# EAGLE design shiva (EAGLE 7.3.0)
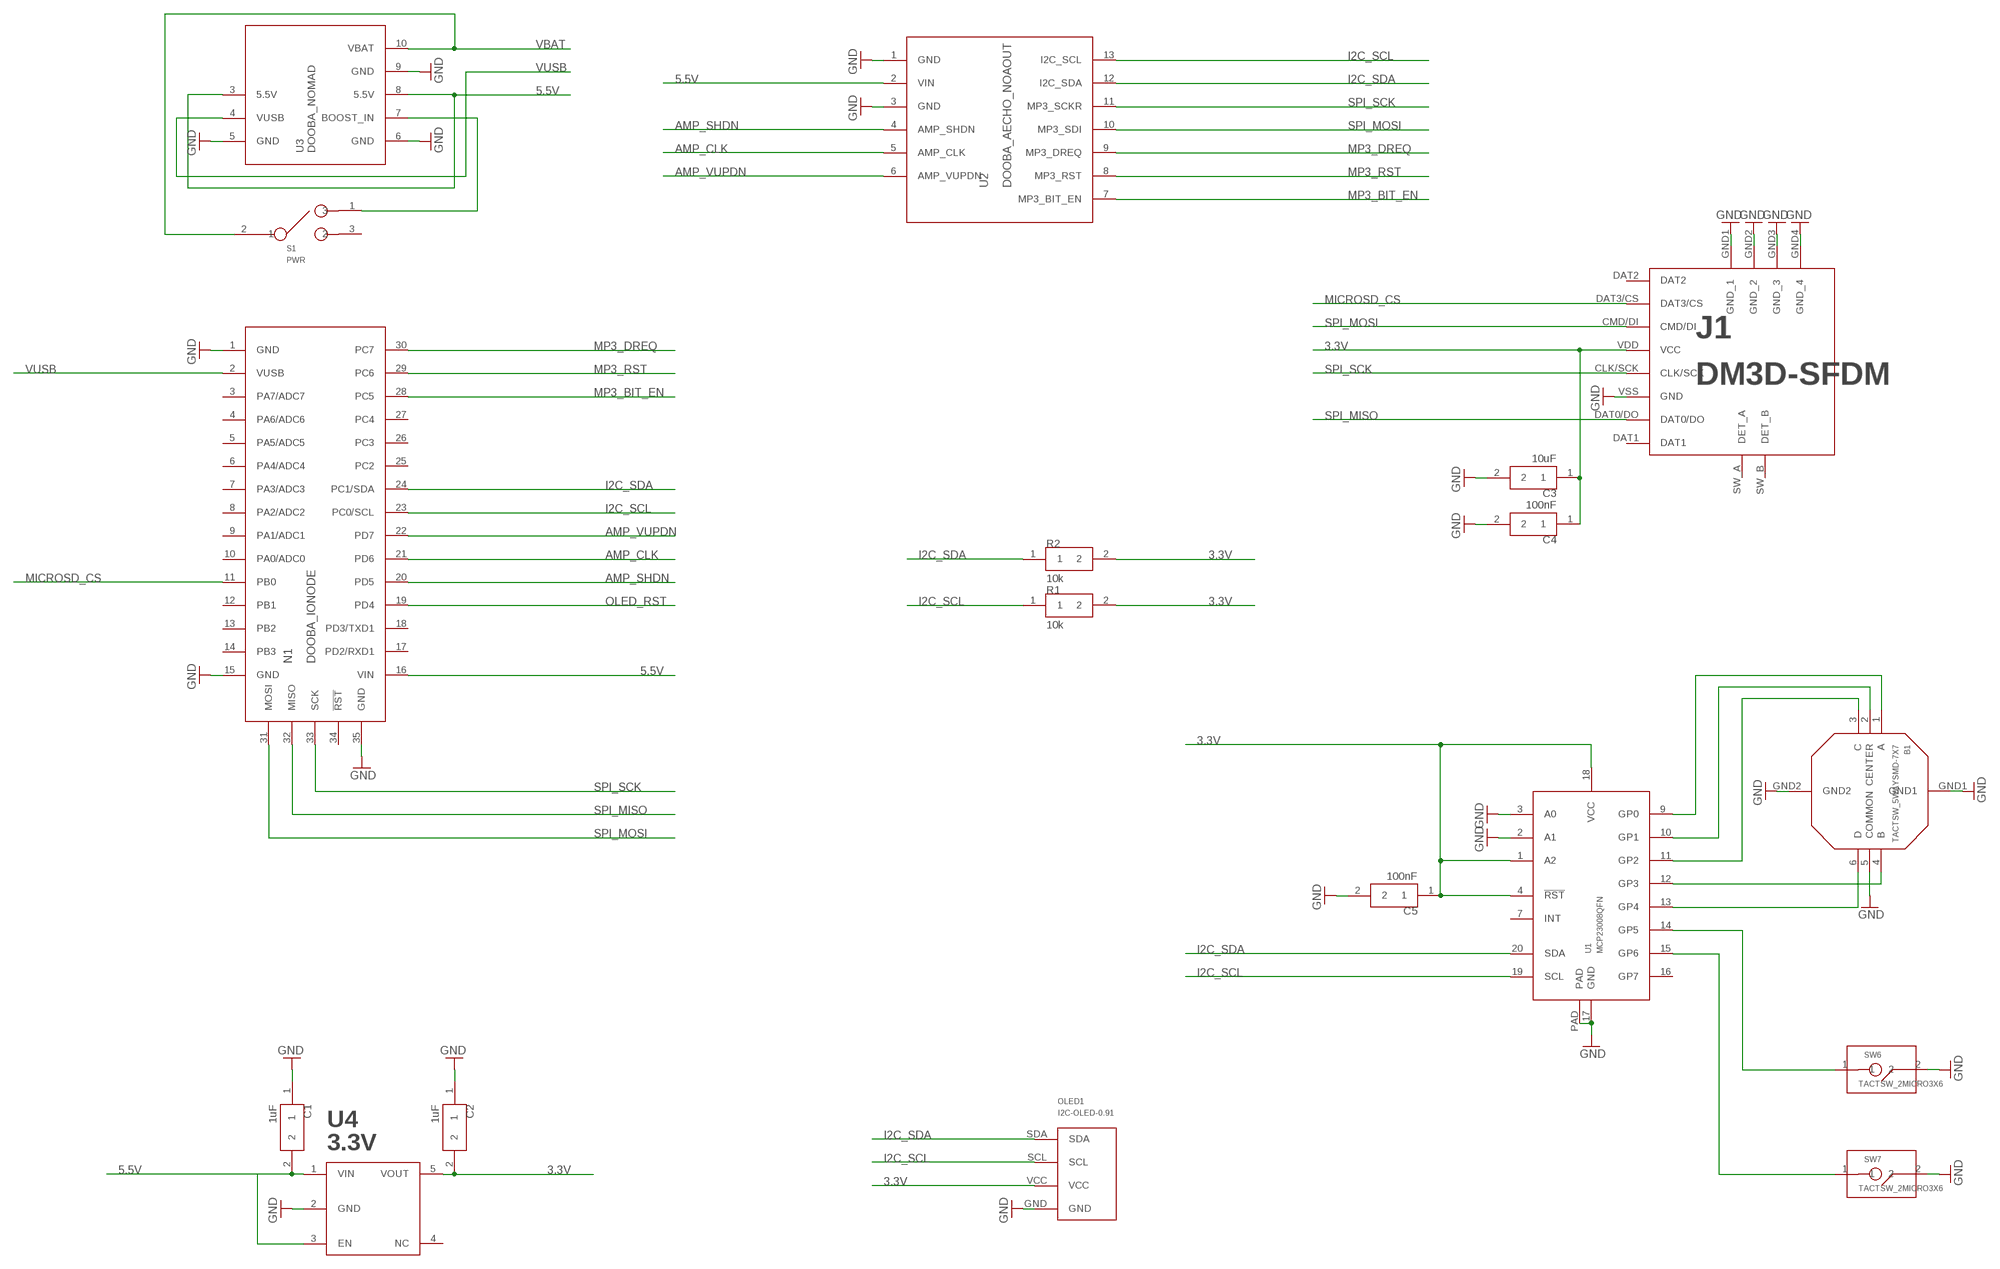
[diagram p0: schematic, sheet 1]

## Parts
B1  TACTSW_5WAYSMD-7X7  [TACTSW-5WAY-7X7]
C1  1uF  CAP0805  [0805]
C2  1uF  CAP0805  [0805]
C3  10uF  CAP0805  [0805]
C4  100nF  CAP0805  [0805]
C5  100nF  CAP0805  [0805]
J1  DM3D-SFDM  [DM3D-SF]
N1  DOOBA_IONODE  [DOOBA_IONODE]
OLED1  I2C-OLED-0.91  [I2C-OLED-0.91]
R1  10k  RES0805  [0805]
R2  10k  RES0805  [0805]
S1  PWR  SWITCH_SPDT  [JS102011]
SW6  TACTSW_2MICRO3X6  [TACTSW_MICRO3X6]
SW7  TACTSW_2MICRO3X6  [TACTSW_MICRO3X6]
U1  MCP23008QFN  [20-VQFN]
U2  DOOBA_AECHO_NOAOUT  [DOOBA_AECHO_NOAOUT]
U3  DOOBA_NOMAD  [DOOBA_NOMAD]
U4  3.3V  LP3985SOT23-5  [SOT23-5]

## Nets
3.3V: C2.2 C3.1 C4.1 C5.1 J1.VDD(VCC) OLED1.VCC R1.2 R2.2 U1.1(A2) U1.4(!RST) U1.18(VCC) U4.5(VOUT)
5.5V: C1.2 N1.16(VIN) U2.2(VIN) U3.3(5.5V) U3.8(5.5V) U4.1(VIN) U4.3(EN)
AMP_CLK: N1.21(PD6) U2.5(AMP_CLK)
AMP_SHDN: N1.20(PD5) U2.4(AMP_SHDN)
AMP_VUPDN: N1.22(PD7) U2.6(AMP_VUPDN)
GND: B1.5(COMMON) B1.GND1 B1.GND2 C1.1 C2.1 C3.2 C4.2 C5.2 J1.GND1(GND_1) J1.GND2(GND_2) J1.GND3(GND_3) J1.GND4(GND_4) J1.VSS(GND) N1.1(GND) N1.15(GND) N1.35(GND) OLED1.GND SW6.2 SW7.2 U1.2(A1) U1.3(A0) U1.17(GND) U1.PAD U2.1(GND) U2.3(GND) U3.5(GND) U3.6(GND) U3.9(GND) U4.2(GND)
I2C_SCL: N1.23(PC0/SCL) OLED1.SCL R1.1 U1.19(SCL) U2.13(I2C_SCL)
I2C_SDA: N1.24(PC1/SDA) OLED1.SDA R2.1 U1.20(SDA) U2.12(I2C_SDA)
MICROSD_CS: J1.DAT3/CS N1.11(PB0)
MP3_BIT_EN: N1.28(PC5) U2.7(MP3_BIT_EN)
MP3_DREQ: N1.30(PC7) U2.9(MP3_DREQ)
MP3_RST: N1.29(PC6) U2.8(MP3_RST)
N$1: B1.1(A) U1.9(GP0)
N$2: B1.2(CENTER) U1.10(GP1)
N$3: B1.3(C) U1.11(GP2)
N$4: B1.6(D) U1.13(GP4)
N$5: B1.4(B) U1.12(GP3)
N$6: SW6.1 U1.14(GP5)
N$7: SW7.1 U1.15(GP6)
N$11: S1.1 U3.7(BOOST_IN)
OLED_RST: N1.19(PD4)
SPI_MISO: J1.DAT0/DO N1.32(MISO)
SPI_MOSI: J1.CMD/DI N1.31(MOSI) U2.10(MP3_SDI)
SPI_SCK: J1.CLK/SCK N1.33(SCK) U2.11(MP3_SCKR)
VBAT: S1.2 U3.10(VBAT)
VUSB: N1.2(VUSB) U3.4(VUSB)
Unconnected: J1.DAT1 J1.DAT2 J1.SW_A(DET_A) J1.SW_B(DET_B) N1.3(PA7/ADC7) N1.4(PA6/ADC6) N1.5(PA5/ADC5) N1.6(PA4/ADC4) N1.7(PA3/ADC3) N1.8(PA2/ADC2) N1.9(PA1/ADC1) N1.10(PA0/ADC0) N1.12(PB1) N1.13(PB2) N1.14(PB3) N1.17(PD2/RXD1) N1.18(PD3/TXD1) N1.25(PC2) N1.26(PC3) N1.27(PC4) N1.34(!RST) S1.3 U1.7(INT) U1.16(GP7) U4.4(NC)

## Library data of the parts
B1 = dooba:TACTSW_5WAY
C1-C5 = dooba:CAP
J1 = dooba:DM3D-SF
N1 = dooba:DOOBA_IONODE
OLED1 = dooba:I2C-OLED-0.91
R1 R2 = dooba:RES
S1 = dooba:SWITCH_SPDT
SW6 SW7 = dooba:TACTSW_2
U1 = dooba:MCP23008
U2 = dooba:DOOBA_AECHO_NOAOUT
U3 = dooba:DOOBA_NOMAD
U4 = dooba:LP3985

## Board
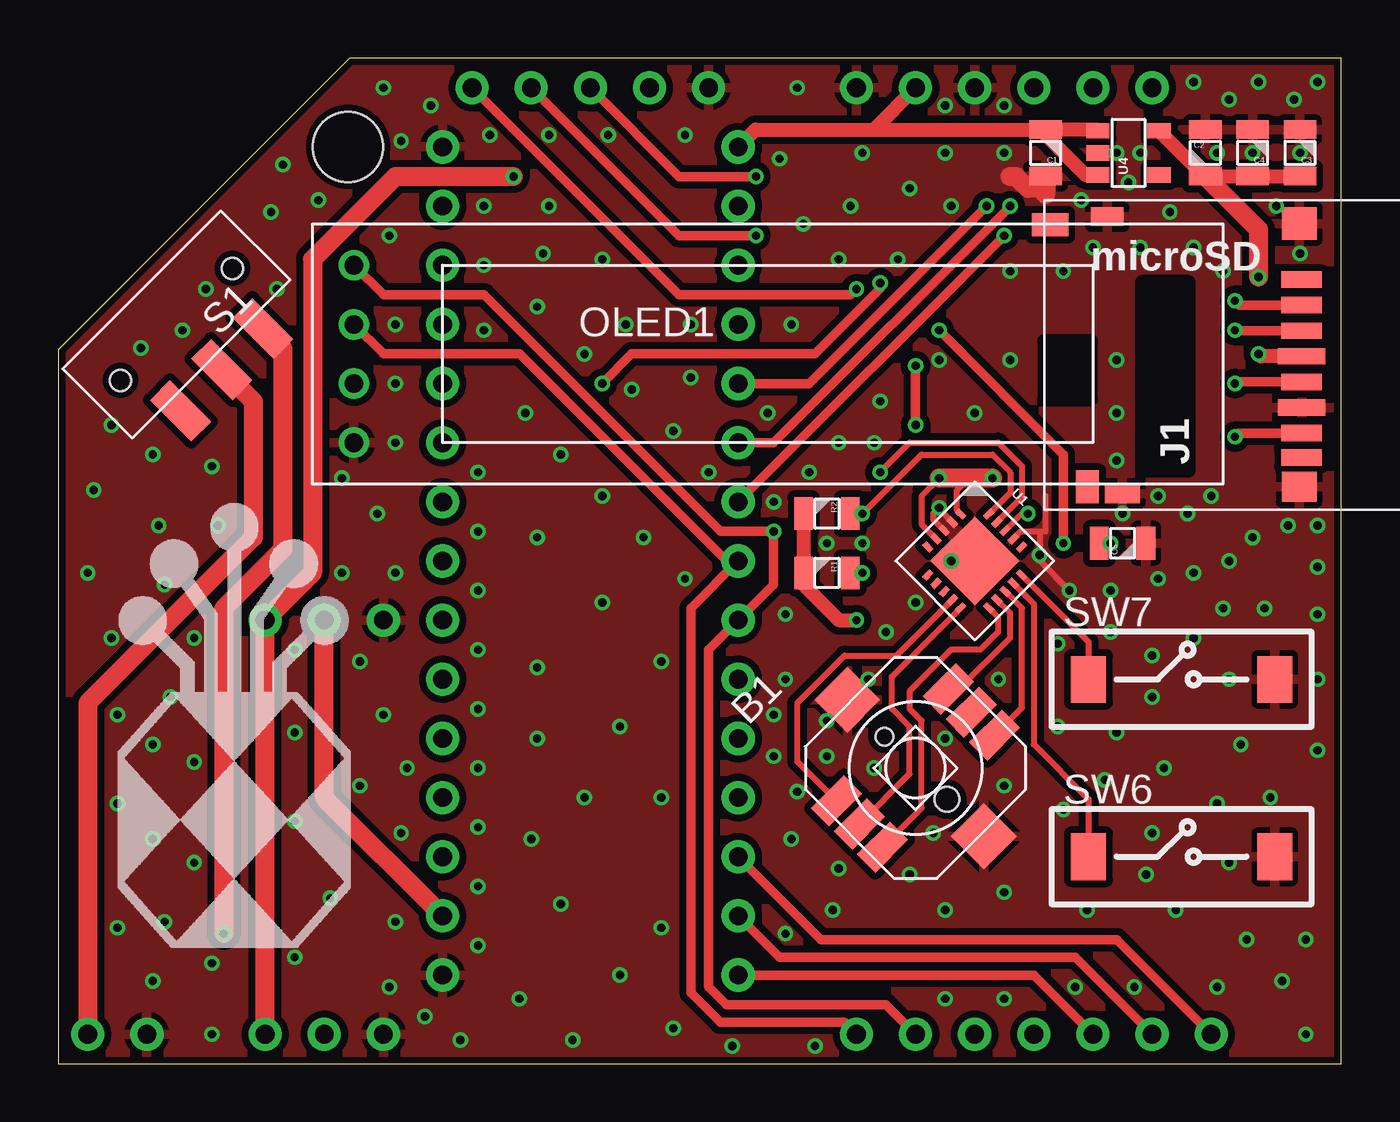
[diagram p1: board, top side]
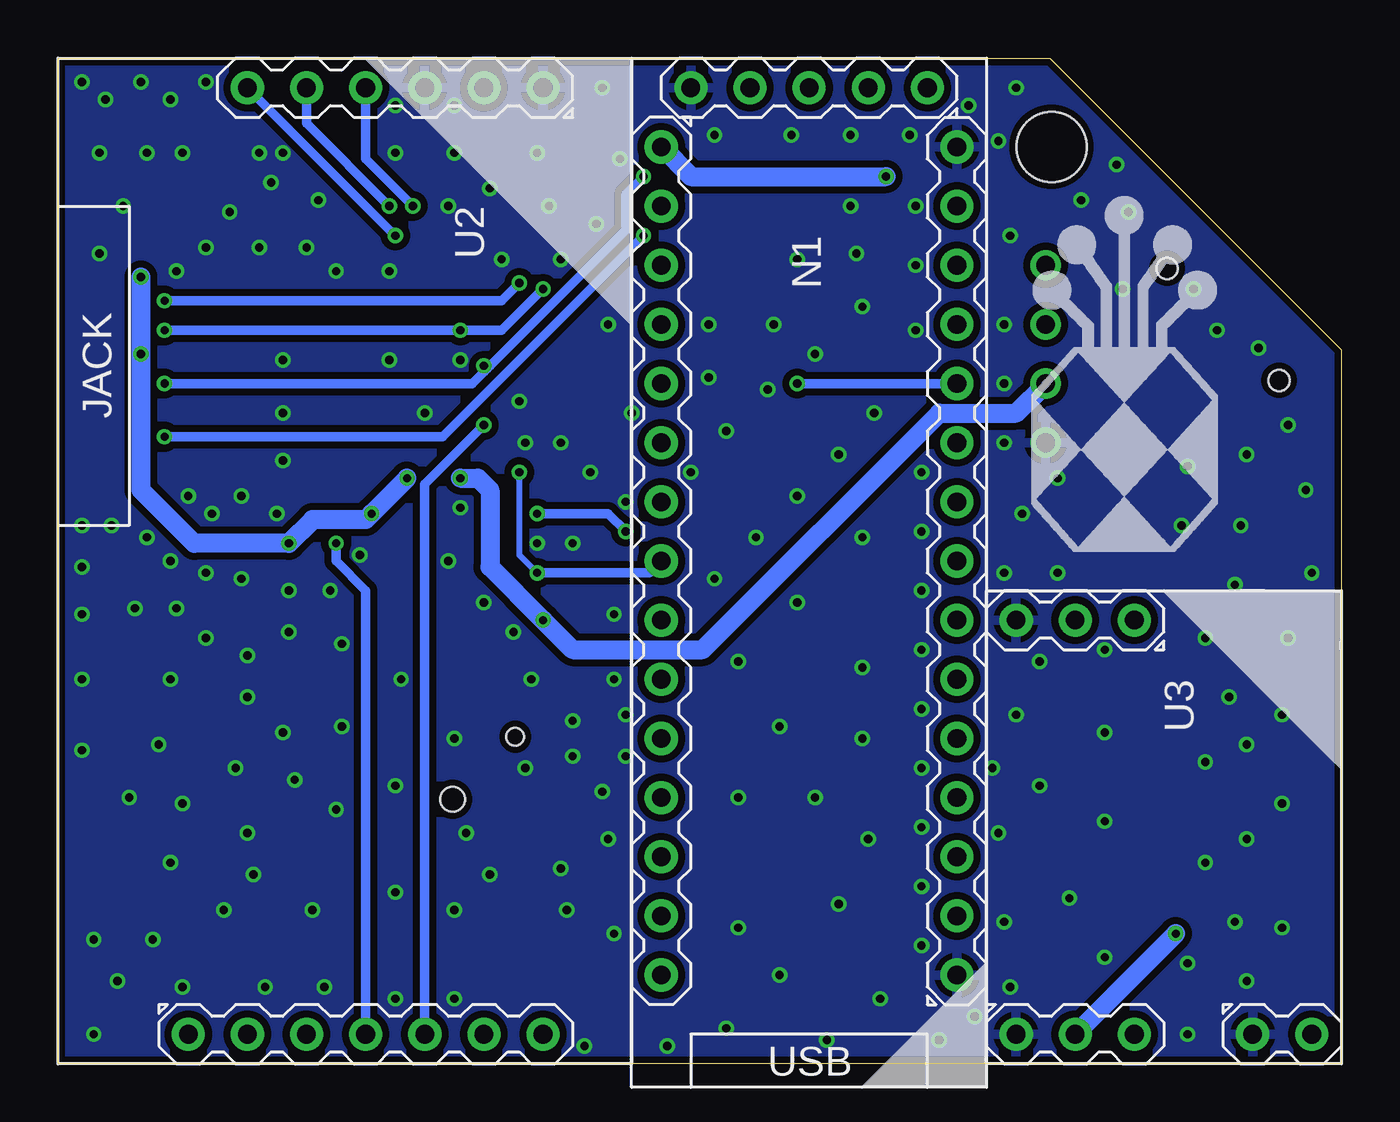
[diagram p2: board, bottom side, seen from below]

Size 55.12 x 43.18 mm. Coordinates in mm from the lower left corner, seen from the top.
Outline: 0,0 55.12,0 55.12,43.18 12.51,43.18 0,30.67 0,0
Copper layers (1*16): Top 0.035mm / dielectric 1.5mm / Bottom 0.035mm
Design rules "dooba": minimum track width 6mil, minimum drill 12mil, track to track 6mil, track to pad 6mil, pad to pad 6mil, via to via 6mil, smd to smd 0mil, copper to edge 10mil, drill to drill 10mil, minimum pad ring 10mil, minimum via ring 6mil, stop-mask expansion 2mil, vias tented up to drill 25mil, thermal gap 10mil
Holes 3 mm at 12.45,39.37

### Footprints (pad centres in the part's own frame; a part is rotated, then mirrored left to right if it is on the bottom)
TACTSW-5WAY-7X7 = smd 2 x 1.1: 1 -3.4,1.4; 2 -3.4,0; 3 -3.4,-1.4; 4 3.4,1.4; 5 3.4,0; 6 3.4,-1.4 | smd 2 x 2: GND1 0,4.15; GND2 0,-4.15 | hole 0.75: 0,1.9 | hole 1.05: 0,-1.9
0805 = smd 0.8 x 1.4: 1 -1,0; 2 1,0
DM3D-SF = smd 0.7 x 1.75: CLK/SCK -1.2,-1.34; CMD/DI 1,-1.34; DAT0/DO -3.4,-1.34; DAT1 -4.45,-1.34; DAT2 3.2,-1.34; DAT3/CS 2.1,-1.34 | smd 0.8 x 1.5: GND1 -6,6.36 | smd 0.8 x 1.4: GND2 5.9,7.01 | smd 1.4 x 1.5: GND3 5.6,-1.24 | smd 1.3 x 1.5: GND4 -5.7,-1.24 | smd 1 x 1.55: SW_A 5.55,9.46 | smd 1.4 x 1: SW_B -5.7,7.86 | smd 0.7 x 2.032: VDD -0.1,-1.34; VSS -2.3,-1.34
DOOBA_IONODE = drill 0.8 pad 1.422: 1 16.51,6.35; 2 13.97,6.35; 3 11.43,6.35; 4 8.89,6.35; 5 6.35,6.35; 6 3.81,6.35; 7 1.27,6.35; 8 -1.27,6.35; 9 -3.81,6.35; 10 -6.35,6.35; 11 -8.89,6.35; 12 -11.43,6.35; 13 -13.97,6.35; 14 -16.51,6.35; 15 -19.05,6.35; 16 -19.05,-6.35; 17 -16.51,-6.35; 18 -13.97,-6.35; 19 -11.43,-6.35; 20 -8.89,-6.35; 21 -6.35,-6.35; 22 -3.81,-6.35; 23 -1.27,-6.35; 24 1.27,-6.35; 25 3.81,-6.35; 26 6.35,-6.35; 27 8.89,-6.35; 28 11.43,-6.35; 29 13.97,-6.35; 30 16.51,-6.35; 31 -21.59,5.08; 32 -21.59,2.54; 33 -21.59,0; 34 -21.59,-2.54; 35 -21.59,-5.08
I2C-OLED-0.91 = drill 0.8: GND -17.78,-3.81; SCL -17.78,1.27; SDA -17.78,3.81; VCC -17.78,-1.27
JS102011 = smd 1.2 x 2.5: 1 -2.5,2.75; 2 0,2.75; 3 2.5,2.75 | hole 0.9: -3.4,0; 3.4,0
TACTSW_MICRO3X6 = smd 1.5 x 2: 1 -4,0; 2 4,0
20-VQFN = smd 0.45 x 0.26: 1 -1.85,1; 2 -1.85,0.5; 3 -1.85,0; 4 -1.85,-0.5; 5 -1.85,-1; 11 1.85,-1; 12 1.85,-0.5; 13 1.85,0; 14 1.85,0.5; 15 1.85,1 | smd 0.26 x 0.45: 6 -1,-1.85; 7 -0.5,-1.85; 8 0,-1.85; 9 0.5,-1.85; 10 1,-1.85; 16 1,1.85; 17 0.5,1.85; 18 0,1.85; 19 -0.5,1.85; 20 -1,1.85 | smd 2.7 x 2.7: PAD 0,0
DOOBA_AECHO_NOAOUT = drill 0.8 pad 1.422: 1 -20.32,6.35; 2 -20.32,3.81; 3 -20.32,1.27; 4 -20.32,-1.27; 5 -20.32,-3.81; 6 -20.32,-6.35; 7 20.32,-8.89; 8 20.32,-6.35; 9 20.32,-3.81; 10 20.32,-1.27; 11 20.32,1.27; 12 20.32,3.81; 13 20.32,6.35
DOOBA_NOMAD = drill 0.8 pad 1.422: 3 -8.89,-1.27; 4 -8.89,-3.81; 5 -8.89,-6.35; 6 8.89,-6.35; 7 8.89,-3.81; 8 8.89,-1.27; 9 8.89,3.81; 10 8.89,6.35
SOT23-5 = smd 0.66 x 1: 1 0.95,1.315; 2 0,1.315; 3 -0.95,1.315; 4 -0.95,-1.315; 5 0.95,-1.315

### Placement (x,y rotation side)
B1  36.83,12.7 45 top
C1  42.42,39.12 90 top
C2  49.28,39.12 270 top
C3  53.34,39.12 90 top
C4  51.31,39.12 90 top
C5  45.72,22.35 0 top
J1  52.07,30.48 90 top
N1  22.86,20.32 270 bottom
OLED1  30.48,30.48 0 top
R1  33.02,21.08 180 top
R2  33.02,23.62 180 top
S1  5.08,31.75 225 top
SW6  48.26,8.89 0 top
SW7  48.26,16.51 0 top
U1  39.37,21.59 315 top
U2  40.64,21.59 270 bottom
U3  7.62,10.16 270 bottom
U4  45.97,39.12 90 top

### Tracks (layer width: path | path; a pad name or v marks a point on that pad's centre or on a via)
3.3V  (via drill 0.36)
  Top 0.254: U1.18 41.4,23.62 v41.66,23.62 | v37.85,25.15 37.08,24.38 37.08,23.17 U1.4 | U1.1 38.61,23.77 38.61,24.64 39.12,25.15
  Top 0.61: U4.5 49.24,38.12 C2.2 C4.1 C3.1 | R2.2 R1.2 32,21.07 32,20.57 33.53,19.05 v34.29,19.05 | J1.VDD 51.66,30.38 v51.56,30.48 | C5.1 v45.21,22.35
  Top 0.813: v40.13,25.15 39.12,25.15 v37.85,25.15 | C2.2 51.56,35.83 v51.56,33.78
  Bottom 0.813: v40.13,25.15 v41.66,23.62 41.91,23.37 44.2,23.37 v45.21,22.35 49.28,22.35 51.56,24.64 v51.56,30.48 v51.56,33.78 | v37.85,25.15 37.08,25.15 36.58,24.64 36.58,21.34 v34.29,19.05 33.02,17.78 27.43,17.78 17.27,27.94 13.97,27.94 OLED1.VCC
5.5V  (via drill 0.36)
  Top 0.61: U4.1 44.61,40.12 C1.2 | C1.2 42.42,39.88 44.13,38.17 U4.3 | N1.16 29.96,40.12 35.04,40.12 | 35.04,40.12 C1.2 | U2.2 35.04,40.12
  Top 0.813: v19.56,38.1 14.48,38.1 10.92,34.54 10.92,21.08 U3.3 U3.8
  Bottom 0.813: N1.16 27.94,38.1 v19.56,38.1
AMP_CLK  (via drill 0.36)
  Top 0.406: N1.21 30.73,26.67 v40.89,36.83
  Bottom 0.406: v40.89,36.83 44.45,40.39 U2.5
AMP_SHDN  (via drill 0.36)
  Top 0.406: N1.20 32.26,29.21 v39.88,36.83
  Bottom 0.406: v39.88,36.83 41.91,38.86 U2.4
AMP_VUPDN  (via drill 0.36)
  Top 0.406: N1.22 v40.64,35.56
  Bottom 0.406: v40.64,35.56 U2.6
GND  (via drill 0.36)
  Top 0.254: U1.17 41.35,22.86 42.16,22.86 | 42.16,22.86 42.16,21.59 v43.43,20.32 | U1.3 37.59,23.37 37.59,23.62 v37.85,23.88 37.85,23.82 U1.2 | U1.PAD v38.35,21.59 | 42.16,22.86 42.42,22.86 42.42,24.38
  Top 0.813: C1.1 42.42,37.34 42.16,37.59 41.66,37.59 41.15,38.1 40.89,38.1
  other vias: 38.1,41.15 40.64,41.15 40.64,39.12 38.1,39.12 36.07,34.54 38.35,36.83 33.53,34.54 32,36.07 30.99,38.86 34.54,39.12 36.58,37.59 34.04,36.83 26.92,39.88 31.75,41.91 23.62,39.88 21.08,39.88 18.54,39.88 13.97,41.91 9.65,38.61 11.18,37.08 9.14,36.58 14.22,35.56 14.48,31.75 14.48,29.21 14.48,26.67 18.29,31.5 22.61,30.48 27.18,31.75 24.38,31.75 21.08,36.83 18.29,36.83 18.29,34.29 20.57,32.51 23.37,34.54 20.83,34.8 31.5,31.75 30.48,27.94 24.64,28.96 27.18,29.46 27.94,25.4 26.42,27.18 35.31,28.45 35.05,26.67 30.73,24.13 32.26,25.4 33.53,26.67 33.02,22.35 31.24,19.3 36.83,19.81 35.56,18.54 31.24,16.51 26.92,20.83 25.15,22.61 23.37,24.38 21.59,26.16 20.07,27.94 14.48,21.08 12.19,21.08 12.19,25.15 13.72,23.62 18.03,25.4 25.91,17.27 23.37,19.81 20.57,22.61 42.93,18.03 45.21,18.54 47.24,20.83 45.21,20.32 47.24,24.38 49.53,24.38 48.51,23.62 48.77,21.08 50.29,21.59 51.31,22.61 34.54,22.35 34.8,16.51 33.02,14.73 40.39,16.51 38.1,13.97 30.73,14.99 30.73,13.21 31.75,11.68 37.59,9.91 40.64,11.94 40.64,7.37 38.1,6.6 33.27,6.6 31.5,9.65 36.58,8.13 33.53,8.38 35.05,12.7 33.02,13.21 43.18,10.92 42.93,14.48 44.96,12.19 52.83,23.11 54.1,23.11 54.1,21.34 54.1,19.3 54.1,16.51 54.1,13.46 51.82,19.56 48.77,18.29 46.99,15.75 50.8,13.72 47.5,12.7 52.07,11.43 46.99,9.91 50.29,8.64 49.78,11.18 50.29,16.51 39.37,27.94 45.47,27.94 45.47,25.91 45.72,23.62 45.47,30.23 40.89,30.23 37.85,30.23 40.89,34.04 44.45,35.05 43.18,34.04 46.48,35.05 50.04,34.04 48.77,35.05 47.75,36.58 43.94,37.08 52.32,36.83 53.34,34.8 53.34,39.12 51.31,39.12 49.78,39.12 54.1,42.16 48.77,42.16 51.56,42.16 50.29,41.4 53.09,41.4 46.48,39.12 45.47,39.12 45.97,37.85 40.64,2.79 44.2,6.6 48.01,6.6 49.78,3.3 53.59,1.27 53.59,5.33 51.05,5.33 52.58,3.56 46.99,17.53 50.04,19.56 45.47,14.22 46.74,8.13 16,41.15 14.73,39.62 9.4,33.27 6.35,33.27 3.56,30.73 5.33,31.5 2.29,27.43 4.06,26.16 6.6,25.65 6.86,23.11 4.57,20.57 2.29,18.29 1.27,21.08 4.32,23.11 1.52,24.64 5.84,18.29 2.54,14.99 5.84,12.95 4.83,15.75 2.54,11.18 5.84,8.64 2.54,5.84 6.6,4.32 6.6,1.27 4.06,3.56 4.06,13.72 4.06,9.65 4.57,6.1 10.16,17.78 10.16,14.22 10.16,10.41 14.48,6.1 10.16,4.57 14.22,3.3 11.68,7.11 14.73,9.91 12.95,11.94 12.95,17.27 13.97,14.99 14.99,12.7 15.75,2.03 17.27,1.02 22.1,1.02 32.51,0.76 28.96,0.76 26.42,1.52 19.81,2.79 24.13,3.81 25.91,5.84 25.91,11.43 24.13,14.48 18.03,20.32 18.03,17.78 18.03,15.24 18.03,12.7 18.03,10.16 18.03,7.62 18.03,5.08 18.03,22.86 21.59,6.86 22.61,11.43 20.57,17.02 20.32,9.65 20.57,13.97 31.24,5.59 38.1,2.79 43.69,3.3 46.23,3.3 42.16,21.84
  pour Top (isolate 0.305): 12.45,43.18 55.88,43.18 55.88,0 0,0 0,30.73
  pour Bottom (isolate 0.305): 12.45,43.18 55.88,43.18 55.88,0 0,0 0,30.73
I2C_SCL  (via drill 0.36)
  Top 0.254: v35.31,25.4 36.58,26.67 40.39,26.67 41.4,25.65 41.4,24.33 U1.19
  Top 0.406: OLED1.SCL 13.97,30.48 19.81,30.48 28.7,21.59 N1.23 27.18,19.56 27.18,3.05 28.45,1.78 33.78,1.78 U2.13 | v34.54,21.08 R1.1
  Bottom 0.254: v34.54,21.08 35.31,21.84 v35.31,25.4
  Bottom 0.406: N1.23 29.72,21.08 v34.54,21.08
I2C_SDA  (via drill 0.36)
  Top 0.254: v34.54,23.62 37.08,26.16 40.13,26.16 40.89,25.4 40.89,24.53 U1.20
  Top 0.406: OLED1.SDA 13.97,33.02 18.29,33.02 28.45,22.86 v30.73,22.86 30.73,20.57 N1.24 27.94,17.78 27.94,3.3 28.7,2.54 35.56,2.54 U2.12 | v34.54,23.62 R2.1
  Bottom 0.406: v30.73,22.86 31.5,23.62 v34.54,23.62
MICROSD_CS  (via drill 0.36)
  Top 0.406: v23.37,29.21 24.64,30.48 32.51,30.48 35.31,33.27 v35.31,33.53 | v50.55,32.77 50.73,32.58 J1.DAT3/CS
  Bottom 0.406: N1.11 v23.37,29.21 | v35.31,33.53 36.07,32.77 v50.55,32.77
MP3_BIT_EN
  Top 0.406: N1.28 32.77,5.33 45.47,5.33 U2.7
MP3_DREQ
  Top 0.406: U2.9 41.91,3.81 N1.30
MP3_RST
  Top 0.406: U2.8 43.69,4.57 30.99,4.57 N1.29
N$1
  Top 0.254: B1.1 31.75,12.97 31.75,15.49 33.78,17.53 36.01,17.53 U1.9
N$2
  Top 0.254: B1.2 36.58,12.45 36.58,14.48 35.81,15.24 35.81,16.62 U1.10
N$3
  Top 0.254: B1.3 37.08,10.97 37.08,14.73 36.58,15.24 36.58,16 38.35,17.78 39.62,17.78 40.39,18.54 40.39,19.16 U1.11
N$4
  Top 0.254: B1.6 41.4,15.29 41.4,19.56 U1.13
N$5
  Top 0.254: B1.4 38.7,16.09 40.89,18.29 40.89,19.36 U1.12
N$6
  Top 0.254: U1.14 41.91,19.76 41.91,13.72 44.26,11.37 SW6.1
N$7
  Top 0.254: U1.15 44.26,18.11 SW7.1
N$11  (via drill 0.36)
  Top 0.813: S1.1 9.65,30.71 9.65,22.1 7.11,19.56 v7.11,5.59
  Bottom 0.813: v7.11,5.59 U3.7
SPI_MISO  (via drill 0.36)
  Top 0.406: N1.32 26.67,35.56 v29.97,35.56 | v50.55,26.92 50.7,27.08 J1.DAT0/DO
  Bottom 0.406: v29.97,35.56 38.61,26.92 v50.55,26.92
SPI_MOSI  (via drill 0.36)
  Top 0.406: N1.31 26.67,33.02 34.04,33.02 v34.29,33.27 | v50.55,31.5 50.56,31.48 J1.CMD/DI | v37.85,31.5 43.18,26.16 v43.18,22.35
  Bottom 0.406: v50.55,31.5 v37.85,31.5 36.07,31.5 v34.29,33.27 | U2.10 41.91,20.32 43.18,21.59 v43.18,22.35
SPI_SCK  (via drill 0.36)
  Top 0.406: N1.33 26.67,38.1 v29.97,38.1 | v50.55,29.21 50.62,29.28 J1.CLK/SCK | v36.83,27.43 v36.83,29.97
  Bottom 0.406: v29.97,38.1 30.73,37.34 30.73,35.81 36.58,29.97 | v50.55,29.21 37.34,29.21 36.83,29.72 36.7,29.84 | U2.11 39.37,24.89 v36.83,27.43 | 36.7,29.84 v36.83,29.97 36.58,29.97 | 36.58,29.97 36.7,29.84
VBAT
  Top 0.813: S1.2 8.38,28.45 8.38,22.61 1.27,15.49 U3.10
VUSB
  Top 0.813: N1.2 11.43,11.43 U3.4